# EAGLE design main (EAGLE 6.6.0)
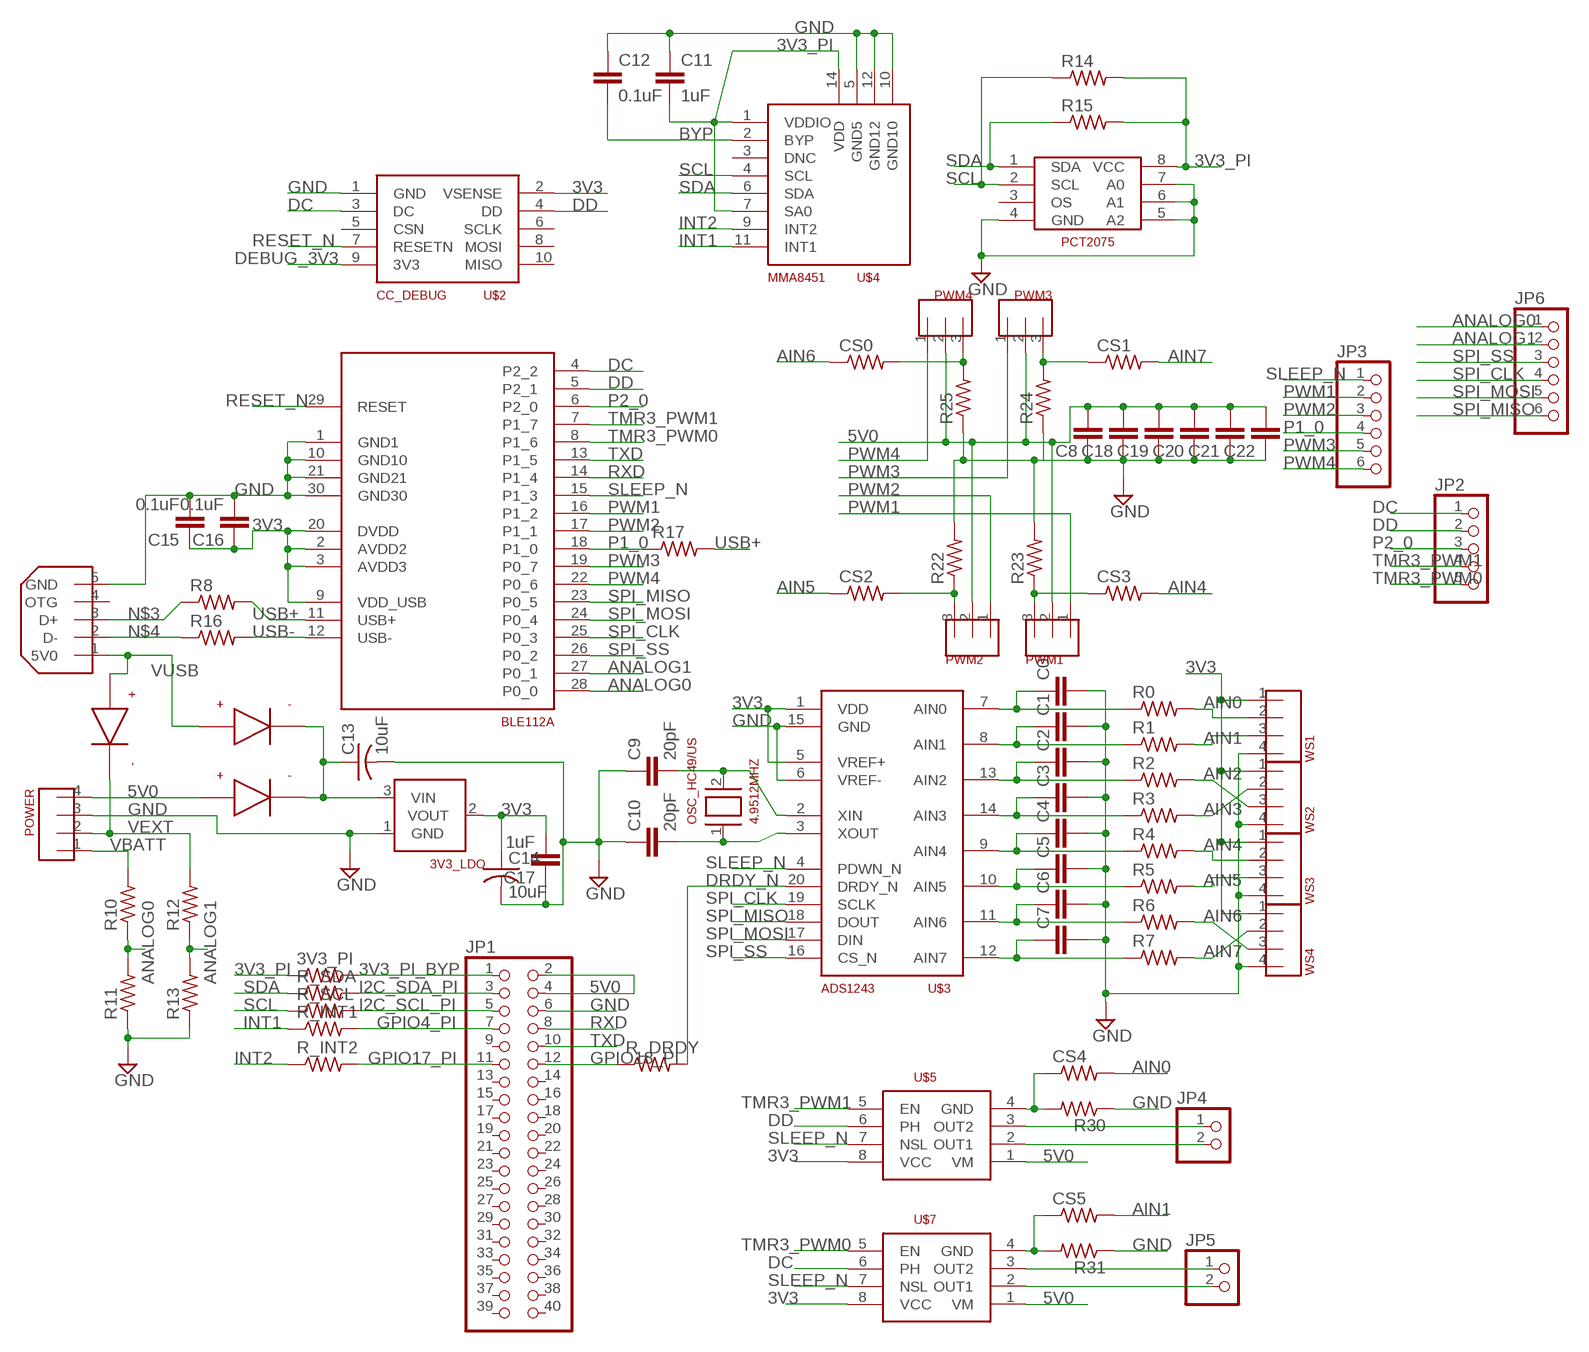
[diagram p0: schematic, sheet 1]

## Parts
3V3_LDO  MCP1700  [SOT23]
3V3_PI  R-US_R0603  [R0603]
4.9512MHZ  OSC_HC49/US  [HC49UP]
BLE112A  BLE112A  [BLE112]
C0  C-EUC0603  [C0603]
C1  C-EUC0603  [C0603]
C2  C-EUC0603  [C0603]
C3  C-EUC0603  [C0603]
C4  C-EUC0603  [C0603]
C5  C-EUC0603  [C0603]
C6  C-EUC0603  [C0603]
C7  C-EUC0603  [C0603]
C8  C-EUC0603  [C0603]
C9  20pF  C-EUC0603  [C0603]
C10  20pF  C-EUC0603  [C0603]
C11  1uF  C-EUC0603  [C0603]
C12  0.1uF  C-EUC0603  [C0603]
C13  10uF  C-USC0805  [C0805]
C14  10uF  C-USC0805  [C0805]
C15  0.1uF  C-EUC0603  [C0603]
C16  0.1uF  C-EUC0603  [C0603]
C17  1uF  C-EUC0603  [C0603]
C18  C-EUC0603  [C0603]
C19  C-EUC0603  [C0603]
C20  C-EUC0603  [C0603]
C21  C-EUC0603  [C0603]
C22  C-EUC0603  [C0603]
CS0  R-US_R0603  [R0603]
CS1  R-US_R0603  [R0603]
CS2  R-US_R0603  [R0603]
CS3  R-US_R0603  [R0603]
CS4  R-US_R0603  [R0603]
CS5  R-US_R0603  [R0603]
JP1  PINHD-2X20  [2X20]
JP2  PINHD-1X5  [1X05]
JP3  PINHD-1X6  [1X06]
JP4  PINHD-1X2  [1X02]
JP5  PINHD-1X2  [1X02]
JP6  PINHD-1X6  [1X06]
PCT2075  PCT2075  [SO-08]
POWER  HDR_SPOX4  [HDR_SPOX4]
PWM1  HDR_1X3  [HDR_1X3]
PWM2  HDR_1X3  [HDR_1X3]
PWM3  HDR_1X3  [HDR_1X3]
PWM4  HDR_1X3  [HDR_1X3]
R0  R-US_R0603  [R0603]
R1  R-US_R0603  [R0603]
R2  R-US_R0603  [R0603]
R3  R-US_R0603  [R0603]
R4  R-US_R0603  [R0603]
R5  R-US_R0603  [R0603]
R6  R-US_R0603  [R0603]
R7  R-US_R0603  [R0603]
R8  R-US_R0603  [R0603]
R10  R-US_R0603  [R0603]
R11  R-US_R0603  [R0603]
R12  R-US_R0603  [R0603]
R13  R-US_R0603  [R0603]
R14  R-US_R0603  [R0603]
R15  R-US_R0603  [R0603]
R16  R-US_R0603  [R0603]
R17  R-US_R0603  [R0603]
R22  R-US_R1206  [R1206]
R23  R-US_R1206  [R1206]
R24  R-US_R1206  [R1206]
R25  R-US_R1206  [R1206]
R30  R-US_R1206  [R1206]
R31  R-US_R1206  [R1206]
R_DRDY  R-US_R0603  [R0603]
R_INT1  R-US_R0603  [R0603]
R_INT2  R-US_R0603  [R0603]
R_SCL  R-US_R0603  [R0603]
R_SDA  R-US_R0603  [R0603]
U$1  SCHOTTKEY_DIODE_1206  [DIODE_1206]
U$2  CC_DEBUG  [HDR_2X5_127MM]
U$3  ADS1243  [TSSOP20]
U$4  MMA8451  [QFN16_3X3]
U$5  DRV8838  [WSON-8-PAD]
U$6  MICRO_USB  [MICRO_USB]
U$7  DRV8838  [WSON-8-PAD]
U$11  SCHOTTKEY_DIODE_1206  [DIODE_1206]
U$12  SCHOTTKEY_DIODE_1206  [DIODE_1206]
WS1  HDR_1X4  [HDR_1X4]
WS2  HDR_1X4  [HDR_1X4]
WS3  HDR_1X4  [HDR_1X4]
WS4  HDR_1X4  [HDR_1X4]

## Nets
3V3: 3V3_LDO.2(VOUT) BLE112A.2(AVDD2) BLE112A.3(AVDD3) BLE112A.9(VDD_USB) BLE112A.20(DVDD) C14.1 C15.1 C16.1 C17.2 U$2.2(VSENSE) U$3.1(VDD) U$3.5(VREF+) U$5.8(VCC) U$7.8(VCC) WS1.1 WS2.1 WS3.1 WS4.1
3V3_PI: 3V3_PI.1 C11.2 PCT2075.8(VCC) R14.2 R15.2 U$4.1(VDDIO) U$4.7(SA0) U$4.14(VDD)
3V3_PI_BYP: 3V3_PI.2 JP1.1
5V0: C8.2 C18.2 C19.2 C20.2 C21.2 C22.2 JP1.2 JP1.4 POWER.4 PWM1.2 PWM2.2 PWM3.2 PWM4.2 U$5.1(VM) U$7.1(VM) U$12.CATHODE+
AIN0: CS4.2 R0.2 WS1.2
AIN1: CS5.2 R1.2 WS1.3
AIN2: R2.2 WS2.3
AIN3: R3.2 WS2.2
AIN4: CS3.2 R4.2 WS3.2
AIN5: CS2.1 R5.2 WS3.3
AIN6: CS0.1 R6.2 WS4.3
AIN7: CS1.2 R7.2 WS4.2
ANALOG0: BLE112A.28(P0_0) JP6.1 R10.1 R11.2
ANALOG1: BLE112A.27(P0_1) JP6.2 R12.1 R13.2
BYP: C12.2 U$4.2(BYP)
DC: BLE112A.4(P2_2) JP2.1 U$2.3(DC) U$7.6(PH)
DD: BLE112A.5(P2_1) JP2.2 U$2.4(DD) U$5.6(PH)
DEBUG_3V3: U$2.9(3V3)
DRDY_N: R_DRDY.2 U$3.20(DRDY_N)
GND: 3V3_LDO.1(GND) BLE112A.1(GND1) BLE112A.10(GND10) BLE112A.21(GND21) BLE112A.30(GND30) C0.2 C1.2 C2.2 C3.2 C4.2 C5.2 C6.2 C7.2 C8.1 C9.1 C10.1 C11.1 C12.1 C13.2 C14.2 C15.2 C16.2 C17.1 C18.1 C19.1 C20.1 C21.1 C22.1 JP1.6 PCT2075.4(GND) PCT2075.5(A2) PCT2075.6(A1) PCT2075.7(A0) POWER.3 R11.1 R13.1 R22.2 R23.2 R24.1 R25.1 R30.1 R31.1 U$2.1(GND) U$3.6(VREF-) U$3.15(GND) U$4.5(GND5) U$4.10(GND10) U$4.12(GND12) U$6.5(GND) WS1.4 WS2.4 WS3.4 WS4.4
GPIO4_PI: JP1.7 R_INT1.2
GPIO17_PI: JP1.11 R_INT2.2
GPIO18_PI: JP1.12 R_DRDY.1
I2C_SCL_PI: JP1.5 R_SCL.2
I2C_SDA_PI: JP1.3 R_SDA.2
INT1: R_INT1.1 U$4.11(INT1)
INT2: R_INT2.1 U$4.9(INT2)
N$1: C0.1 R0.1 U$3.7(AIN0)
N$2: C1.1 R1.1 U$3.8(AIN1)
N$3: R8.1 U$6.3(D+)
N$4: R16.1 U$6.2(D-)
N$5: 3V3_LDO.3(VIN) C13.1 U$11.ANODE- U$12.ANODE-
N$6: C2.1 R2.1 U$3.13(AIN2)
N$7: C3.1 R3.1 U$3.14(AIN3)
N$8: C4.1 R4.1 U$3.9(AIN4)
N$9: C5.1 R5.1 U$3.10(AIN5)
N$10: C6.1 R6.1 U$3.11(AIN6)
N$11: C7.1 R7.1 U$3.12(AIN7)
N$12: JP4.1 U$5.3(OUT2)
N$13: CS2.2 PWM2.3 R22.1
N$14: CS3.1 PWM1.3 R23.1
N$15: CS0.2 PWM4.3 R25.2
N$16: CS1.1 PWM3.3 R24.2
N$21: JP4.2 U$5.2(OUT1)
N$22: JP5.1 U$7.3(OUT2)
N$23: JP5.2 U$7.2(OUT1)
N$24: 4.9512MHZ.2 C9.2 U$3.2(XIN)
N$25: 4.9512MHZ.1 C10.2 U$3.3(XOUT)
N$26: CS4.1 R30.2 U$5.4(GND)
N$27: CS5.1 R31.2 U$7.4(GND)
P1_0: BLE112A.18(P1_0) JP3.4 R17.1
P2_0: BLE112A.6(P2_0) JP2.3
PWM1: BLE112A.16(P1_2) JP3.2 PWM1.1
PWM2: BLE112A.17(P1_1) JP3.3 PWM2.1
PWM3: BLE112A.19(P0_7) JP3.5 PWM3.1
PWM4: BLE112A.22(P0_6) JP3.6 PWM4.1
RESET_N: BLE112A.29(RESET) U$2.7(RESETN)
RXD: BLE112A.14(P1_4) JP1.8
SCL: PCT2075.2(SCL) R14.1 R_SCL.1 U$4.4(SCL)
SDA: PCT2075.1(SDA) R15.1 R_SDA.1 U$4.6(SDA)
SLEEP_N: BLE112A.15(P1_3) JP3.1 U$3.4(PDWN_N) U$5.7(NSL) U$7.7(NSL)
SPI_CLK: BLE112A.25(P0_3) JP6.4 U$3.19(SCLK)
SPI_MISO: BLE112A.23(P0_5) JP6.6 U$3.18(DOUT)
SPI_MOSI: BLE112A.24(P0_4) JP6.5 U$3.17(DIN)
SPI_SS: BLE112A.26(P0_2) JP6.3 U$3.16(CS_N)
TMR3_PWM0: BLE112A.8(P1_6) JP2.5 U$7.5(EN)
TMR3_PWM1: BLE112A.7(P1_7) JP2.4 U$5.5(EN)
TXD: BLE112A.13(P1_5) JP1.10
USB+: BLE112A.11(USB+) R8.2 R17.2
USB-: BLE112A.12(USB-) R16.2
VBATT: POWER.1 R10.2
VEXT: POWER.2 R12.2 U$1.ANODE-
VUSB: U$1.CATHODE+ U$6.1(5V0) U$11.CATHODE+
Unconnected: JP1.9 JP1.13 JP1.14 JP1.15 JP1.16 JP1.17 JP1.18 JP1.19 JP1.20 JP1.21 JP1.22 JP1.23 JP1.24 JP1.25 JP1.26 JP1.27 JP1.28 JP1.29 JP1.30 JP1.31 JP1.32 JP1.33 JP1.34 JP1.35 JP1.36 JP1.37 JP1.38 JP1.39 JP1.40 PCT2075.3(OS) U$2.5(CSN) U$2.6(SCLK) U$2.8(MOSI) U$2.10(MISO) U$4.3(DNC) U$6.4(OTG)

## Library data of the parts
3V3_LDO = bleHAT:MCP1700
3V3_PI CS0 CS1-CS5 R0 R1-R8 R10-R17 R_DRDY R_INT1 R_INT2 R_SCL R_SDA = rcl:R-US_: RESISTOR, American symbol
4.9512MHZ = bleHAT:OSC_HC49/US
BLE112A = bleHAT:BLE112A
C0 C1-C12 C15-C22 = resistor:C-EU: CAPACITOR, European symbol
C13 C14 = resistor:C-US: CAPACITOR, American symbol
JP1 = pinhead:PINHD-2X20: PIN HEADER
JP2 = bleHAT:PINHD-1X5: PIN HEADER
JP3 JP6 = bleHAT:PINHD-1X6: PIN HEADER
JP4 JP5 = bleHAT:PINHD-1X2: PIN HEADER
PCT2075 = bleHAT:PCT2075
POWER = bleHAT:HDR_SPOX4
PWM1-PWM4 = bleHAT:HDR_1X3
R22-R25 R30 R31 = resistor:R-US_: RESISTOR, American symbol
U$1 U$11 U$12 = bleHAT:SCHOTTKEY_DIODE_1206
U$2 = bleHAT:CC_DEBUG
U$3 = bleHAT:ADS1243
U$4 = bleHAT:MMA8451
U$5 U$7 = bleHAT:DRV8838
U$6 = bleHAT:MICRO_USB
WS1-WS4 = bleHAT:HDR_1X4

## Board
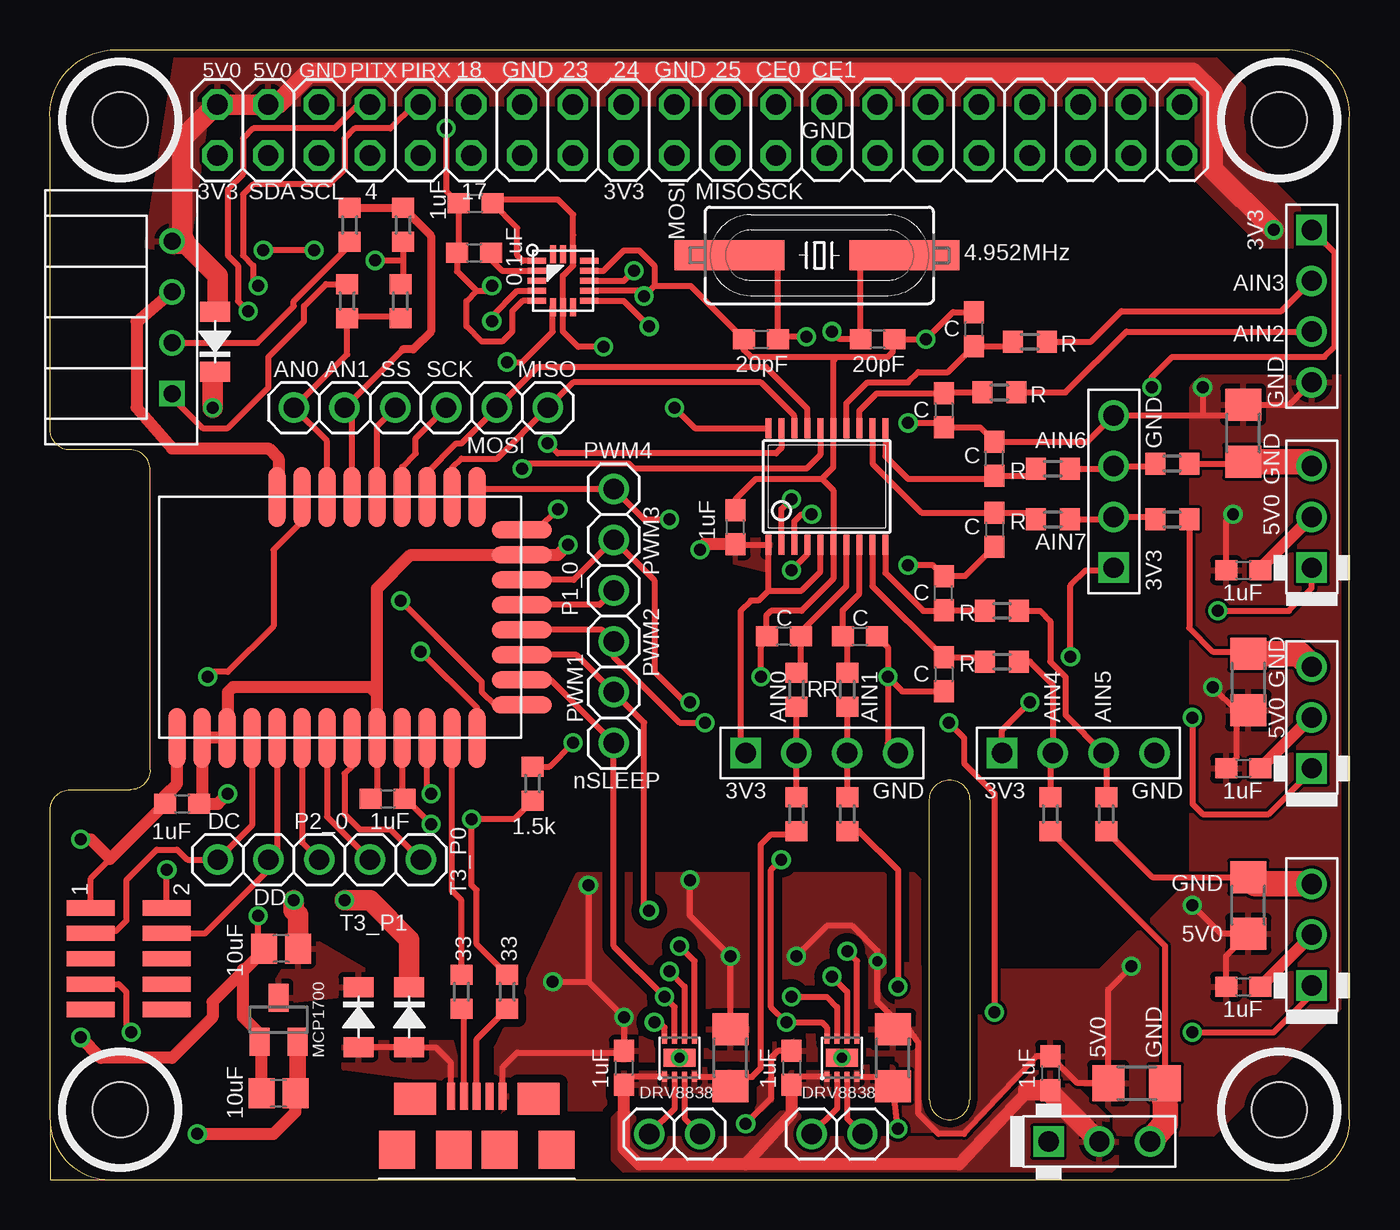
[diagram p1: board, top side]
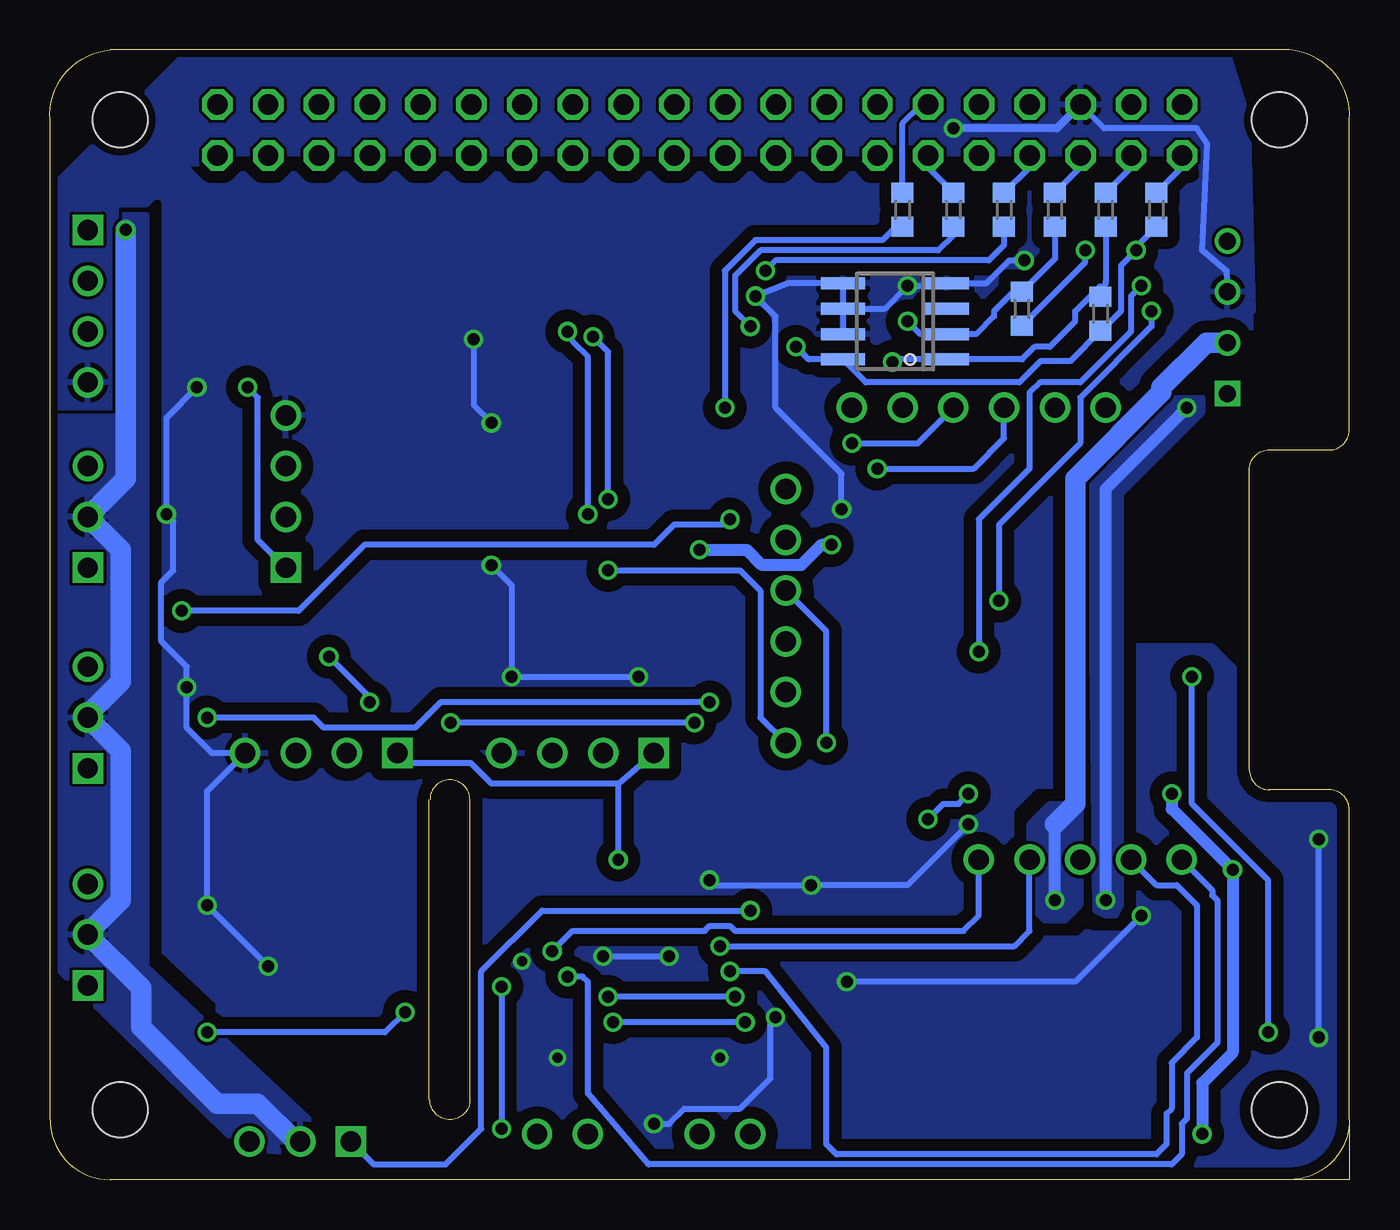
[diagram p2: board, bottom side, seen from below]

Size 65.02 x 56.5 mm. Coordinates in mm from the lower left corner, seen from the top.
Outline: 3.01,0 0.01,0 0.01,3
Outline: 0.01,3 arc90 3.01,0
Outline: 3.01,0 62.01,0 arc90 65.01,3 65.01,53 arc90 62.01,56.5 3.01,56.5 arc90 0.01,53 0.01,37.5 arc90 1.01,36.5 4.01,36.5 arc-90 5.01,35.5 5.01,20.5 arc-90 4.01,19.5 1.01,19.5 arc90 0.01,18.5 0.01,3
Outline: 46.01,19 arc180 44.01,19 44.01,4 arc180 46.01,4
Outline: 46.04,4 46.04,19
Copper layers (1*16): Top 0.0356mm / dielectric 1.5011mm / Bottom 0.0356mm
Design rules "LaenPCBOrder": minimum track width 6mil, minimum drill 13mil, track to track 6mil, track to pad 6mil, pad to pad 6mil, via to via 6mil, smd to smd 6mil, copper to edge 15mil, drill to drill 6mil, minimum pad ring 7mil, minimum via ring 7mil, stop-mask expansion 3mil, vias tented up to drill 0mil, thermal gap 10mil
Holes 2.75 mm at 3.51,3.5 61.51,3.5 3.51,53 61.51,53

### Footprints (pad centres in the part's own frame; a part is rotated, then mirrored left to right if it is on the bottom)
SOT23 = smd 1 x 1.4: 1 -0.95,-1.1; 2 0.95,-1.1; 3 0,1.1
R0603 = smd 1 x 1.1: 1 -0.85,0; 2 0.85,0
HC49UP = smd 5.5 x 1.5: 1 -4.25,0; 2 4.5,0
BLE112 = smd 3 x 0.85: 1 0,0; 2 0,-1.25; 3 0,-2.5; 4 0,-3.75; 5 0,-5; 6 0,-6.25; 7 0,-7.5; 8 0,-8.75; 9 0,-10; 10 0,-11.25; 11 0,-12.5; 12 0,-13.75; 13 0,-15; 22 12.05,-15; 23 12.05,-13.75; 24 12.05,-12.5; 25 12.05,-11.25; 26 12.05,-10; 27 12.05,-8.75; 28 12.05,-7.5; 29 12.05,-6.25; 30 12.05,-5 | smd 0.85 x 3: 14 1.65,-17.25; 15 2.9,-17.25; 16 4.15,-17.25; 17 5.4,-17.25; 18 6.65,-17.25; 19 7.9,-17.25; 20 9.15,-17.25; 21 10.4,-17.25
C0603 = smd 1.1 x 1: 1 -0.85,0; 2 0.85,0
C0805 = smd 1.3 x 1.5: 1 -0.85,0; 2 0.85,0
2X20 = drill 1.016 octagon: 1 -24.13,-1.27; 2 -24.13,1.27; 3 -21.59,-1.27; 4 -21.59,1.27; 5 -19.05,-1.27; 6 -19.05,1.27; 7 -16.51,-1.27; 8 -16.51,1.27; 9 -13.97,-1.27; 10 -13.97,1.27; 11 -11.43,-1.27; 12 -11.43,1.27; 13 -8.89,-1.27; 14 -8.89,1.27; 15 -6.35,-1.27; 16 -6.35,1.27; 17 -3.81,-1.27; 18 -3.81,1.27; 19 -1.27,-1.27; 20 -1.27,1.27; 21 1.27,-1.27; 22 1.27,1.27; 23 3.81,-1.27; 24 3.81,1.27; 25 6.35,-1.27; 26 6.35,1.27; 27 8.89,-1.27; 28 8.89,1.27; 29 11.43,-1.27; 30 11.43,1.27; 31 13.97,-1.27; 32 13.97,1.27; 33 16.51,-1.27; 34 16.51,1.27; 35 19.05,-1.27; 36 19.05,1.27; 37 21.59,-1.27; 38 21.59,1.27; 39 24.13,-1.27; 40 24.13,1.27
1X05 = drill 1.016: 1 -5.08,0; 2 -2.54,0; 3 0,0; 4 2.54,0; 5 5.08,0
1X06 = drill 1.016: 1 -6.35,0; 2 -3.81,0; 3 -1.27,0; 4 1.27,0; 5 3.81,0; 6 6.35,0
1X02 = drill 1.016: 1 -1.27,0; 2 1.27,0
SO-08 = smd 0.6 x 2.2: 1 -1.905,-2.6; 2 -0.635,-2.6; 3 0.635,-2.6; 4 1.905,-2.6; 5 1.905,2.6; 6 0.635,2.6; 7 -0.635,2.6; 8 -1.905,2.6
HDR_SPOX4 = drill 0.85 square: 1 -3.81,0 | drill 0.85: 2 -1.27,0; 3 1.27,0; 4 3.81,0
HDR_1X3 = drill 1.016 square: 1 -2.54,0 | drill 1.016: 2 0,0; 3 2.54,0
R1206 = smd 1.6 x 1.803: 1 -1.422,0; 2 1.422,0
DIODE_1206 = smd 1 x 1.5: ANODE- 1.5,0; CATHODE+ -1.5,0
HDR_2X5_127MM = smd 0.76 x 2.4: 1 -2.54,-2.54; 2 -2.54,1.27; 3 -1.27,-2.54; 4 -1.27,1.27; 5 0,-2.54; 6 0,1.27; 7 1.27,-2.54; 8 1.27,1.27; 9 2.54,-2.54; 10 2.54,1.27
TSSOP20 = smd 0.305 x 0.991: 1 -2.925,-2.918; 2 -2.275,-2.918; 3 -1.625,-2.918; 4 -0.975,-2.918; 5 -0.325,-2.918; 6 0.325,-2.918; 7 0.975,-2.918; 8 1.625,-2.918; 9 2.275,-2.918; 10 2.925,-2.918; 11 2.925,2.918; 12 2.275,2.918; 13 1.625,2.918; 14 0.975,2.918; 15 0.325,2.918; 16 -0.325,2.918; 17 -0.975,2.918; 18 -1.625,2.918; 19 -2.275,2.918; 20 -2.925,2.918
QFN16_3X3 = smd 0.913 x 0.305: 1 -1.3,1; 2 -1.3,0.5; 3 -1.3,0; 4 -1.3,-0.5; 5 -1.3,-1; 9 1.325,-1; 10 1.325,-0.5; 11 1.325,0; 12 1.325,0.5; 13 1.325,1 | smd 0.305 x 0.913: 6 -0.5,-1.325; 7 0,-1.325; 8 0.5,-1.325; 14 0.5,1.325; 15 0,1.325; 16 -0.5,1.325
WSON-8-PAD = smd 0.25 x 0.5: 1 -0.75,-0.95; 2 -0.25,-0.95; 3 0.25,-0.95; 4 0.75,-0.95; 5 0.75,0.95; 6 0.25,0.95; 7 -0.25,0.95; 8 -0.75,0.95 | smd 1.6 x 0.9: PAD 0,0
MICRO_USB = smd 0.4 x 1.35: 1 -1.3,2.675; 2 -0.65,2.675; 3 0,2.675; 4 0.65,2.675; 5 1.3,2.675 | smd 1.8 x 1.9: P$1 -4,0; P$2 4,0; P$3 1.15,0; P$4 -1.15,0 | smd 2.1 x 1.6: P$5 3.1,2.55; P$6 -3.1,2.55
HDR_1X4 = drill 1.016 square: 1 -3.81,0 | drill 1.016: 2 -1.27,0; 3 1.27,0; 4 3.81,0

### Placement (x,y rotation side)
3V3_LDO  11.44,8 0 top
3V3_PI  9.66,48.51 90 bottom
4.9512MHZ  38.49,46.23 180 top
BLE112A  6.36,22.1 90 top
C0  36.71,27.18 180 top
C1  40.52,27.18 0 top
C2  44.71,38.48 270 top
C3  46.24,42.55 90 top
C4  44.71,25.27 270 top
C5  44.71,29.34 90 top
C6  47.25,36.07 90 top
C7  47.25,32.51 270 top
C8  28.71,5.59 270 top
C9  35.57,42.04 0 top
C10  41.41,42.04 180 top
C11  21.28,48.83 0 top
C12  21.22,46.35 0 top
C13  11.57,11.56 180 top
C14  11.44,4.32 180 top
C15  16.9,19.05 0 top
C16  34.3,32.64 90 top
C17  6.61,18.8 0 top
C18  37.09,5.59 270 top
C19  50.05,5.33 270 top
C20  59.7,9.65 0 top
C21  59.7,20.57 0 top
C22  59.7,30.48 0 top
CS0  56.14,35.81 0 top
CS1  56.14,33.02 180 top
CS2  52.84,18.29 270 top
CS3  50.05,18.29 90 top
CS4  37.35,18.29 90 top
CS5  39.89,18.29 90 top
JP1  32.51,52.5 0 top
JP2  13.47,16 0 top
JP3  28.2,28.19 90 top
JP4  31.25,2.29 180 top
JP5  39.38,2.29 180 top
JP6  18.55,38.61 0 top
PCT2075  22.74,42.93 90 bottom
POWER  6.11,43.13 90 top
PWM1  52.5,1.91 0 top
PWM2  63.13,12.26 90 top
PWM3  63.13,23.11 90 top
PWM4  63.13,33.15 90 top
R0  37.35,24.51 270 top
R1  39.89,24.51 270 top
R2  47.51,39.37 0 top
R3  49.03,41.91 0 top
R4  47.63,25.91 0 top
R5  47.63,28.45 0 top
R6  50.17,35.56 0 top
R7  50.17,33.02 0 top
R8  22.87,9.4 90 top
R10  14.87,43.94 90 top
R11  17.54,43.94 270 top
R12  15,47.75 270 top
R13  17.66,47.75 90 top
R14  16.39,43.56 270 bottom
R15  12.46,43.31 270 bottom
R16  20.58,9.4 90 top
R17  24.14,19.81 270 top
R22  59.95,13.72 270 top
R23  54.37,4.83 180 top
R24  59.95,24.89 90 top
R25  59.7,37.34 270 top
R30  34.05,6.1 270 top
R31  42.17,6.1 270 top
R_DRDY  22.36,48.51 270 bottom
R_INT1  17.28,48.51 90 bottom
R_INT2  19.82,48.51 90 bottom
R_SCL  14.74,48.51 90 bottom
R_SDA  12.2,48.51 90 bottom
U$1  17.98,8.13 90 top
U$2  4.58,11.05 270 top
U$3  38.87,34.67 0 top
U$4  25.66,44.96 0 top
U$5  31.51,6.1 0 top
U$6  21.36,1.5 0 top
U$7  39.63,6.1 0 top
U$11  15.44,8.13 90 top
U$12  8.26,41.91 270 top
WS1  38.62,21.34 0 top
WS2  63.13,43.69 270 top
WS3  51.44,21.34 0 top
WS4  53.22,34.42 90 top

### Tracks (layer width: path | path; a pad name or v marks a point on that pad's centre or on a via)
3V3  (via drill 0.6)
  Top 0.305: BLE112A.9 16.36,19.36 C15.1 | 7.61,18.94 C17.2 | U$2.2 v5.85,15.49 | C14.1 12.39,4.93 | U$5.8 30.76,7.61 30.49,7.87 v30.24,7.87 | U$7.8 38.87,7.62 38.62,7.87 v36.84,7.87 36.08,8.64 36.08,15.49 v36.59,16 | 8.9,22.14 BLE112A.3 | C16.1 34.34,31.75 U$3.1 35.95,29.46 | 35.95,29.46 35.44,28.96 35.06,28.96 34.55,28.45 34.55,21.59 WS1.1 | WS3.1 47.63,22.48 v49.03,23.88 | v51.06,26.16 51.06,29.72 51.83,30.48 53.1,30.48 WS4.1 | v55.13,39.62 55.13,40.13 56.14,41.15 63.76,41.15 64.27,41.66 64.27,46.35 WS2.1 | 35.95,29.46 37.6,29.46 38.55,30.41 U$3.5
  Top 0.61: BLE112A.3 BLE112A.2 7.61,18.94 | C17.2 8.39,18.8 v8.9,19.3 | v7.38,2.29 11.19,2.29 12.29,3.39 C14.1 | BLE112A.9 16.36,24.29 | 16.36,24.29 16.01,24.64 9.15,24.64 8.9,24.38 8.9,22.14 | v25.92,31.75 25.42,31.25 BLE112A.20 18.05,31.25 16.36,29.56 16.36,24.29 | C16.1 32.74,31.79 v32.52,31.5
  Top 0.813: 12.39,4.93 3V3_LDO.2
  Bottom 0.305: v30.24,7.87 v36.84,7.87 | v36.59,16 36.59,19.81 | 36.59,19.81 WS1.1 | 36.59,19.81 42.94,19.81 43.95,20.83 47.13,20.83 WS3.1 | v49.03,23.88 49.03,24.13 v51.06,26.16 | WS4.1 54.62,32 54.62,39.12 v55.13,39.62
  Bottom 0.61: v8.9,19.3 8.9,18.54 v5.85,15.49 5.85,6.35 7.38,4.83 v7.38,2.29 | v25.92,31.75 26.43,31.75 27.44,30.73 29.4,30.73 30.16,31.5 v32.52,31.5
  pour Top: 34.3,32 36.08,32 35.82,30.48 33.79,30.99
3V3_PI  (via drill 0.6)
  Top 0.305: v27.7,41.66 26.43,41.66 25.66,42.42 U$4.7 25.66,45.21 26.17,45.72 26.17,46.23 U$4.14 26.16,47.24 26.17,47.24 26.17,48.26 25.41,49.02 22.32,49.02 C11.2 23.38,47.59 23.38,46.23 23.65,45.96 U$4.1 | v13.22,46.48 v10.68,46.48
  Bottom 0.305: v27.7,41.66 27.06,41.02 PCT2075.8 24.2,39.88 16.52,39.88 15.46,40.93 13.98,40.93 R15.2 12.42,42.46 11.44,43.43 11.44,45.72 v10.68,46.48 | R14.2 13.22,45.89 v13.22,46.48 | v10.68,46.48 10.42,46.23 | v10.68,46.48 10.68,46.65 3V3_PI.1
3V3_PI_BYP
  Bottom 0.305: 3V3_PI.2 8.38,50.65 JP1.1
5V0  (via drill 0.6)
  Top 0.305: U$5.1 29.12,5.15 C8.2 | U$7.1 37.25,5.15 C18.2 | 10.93,53.85 10.93,53.78 JP1.4
  Top 0.61: C18.2 37.09,3.3 34.81,0.76 | 34.81,0.76 29.47,0.76 28.71,1.52 C8.2 | 48.94,4.48 45.48,0.76 34.81,0.76 | 6.61,46.94 6.67,46.94 | 8.39,43.54 U$12.CATHODE+ | JP1.2 8.31,53.77 | C19.2 50.05,4.36 | PWM2.2 63.13,12.23 C20.2 | C22.2 60.55,30.57 PWM4.2 | 10.93,53.85 11.44,53.85 | C21.2 63.09,23.11
  Top 1.016: C19.2 48.94,4.48 | 6.67,46.94 8.39,45.21 8.39,43.54 | 8.31,53.77 6.61,52.07 6.61,46.94 | JP1.2 JP1.4 | 50.05,4.36 PWM1.2 | 11.44,53.85 12.96,55.37 57.16,55.37 58.18,54.36 58.18,50.55 v61.22,47.5 | 63.09,23.11 PWM3.2
  Top 1.27: POWER.4 6.61,46.94
  Bottom 0.61: PWM1.2 52.71,1.91 | PWM2.2 63.13,12.32
  Bottom 1.016: 52.71,1.91 54.62,3.81 56.65,3.81 60.46,7.62 60.46,9.59 PWM2.2 | 63.13,12.32 61.48,13.97 61.48,21.46 PWM3.2 63.13,23.24 61.48,24.89 61.48,31.5 PWM4.2 61.22,35.05 v61.22,47.5
  pour Top: 28.46,5.33 31.25,5.33 31.25,4.32 28.46,4.32
  pour Top: 39.38,5.33 37.09,5.33 37.09,4.32 39.38,4.32
  pour Top: 6.36,56.39 4.84,46.74 6.87,46.23 7.88,53.85 57.41,53.85 57.41,50.04 60.72,46.74 62.24,46.74 62.49,46.99 62.49,48.51 59.7,51.31 59.7,54.61 57.92,56.39
  pour Bottom (rank 2): 65.03,46.23 62.24,48.26 60.21,48.26 60.21,10.67 52.08,3.05 52.08,1.27 55.38,1.52 65.03,10.92
  pour Top: 53.35,0.76 53.35,2.54 50.56,5.33 49.03,5.33 45.98,2.03 38.62,2.03 37.35,3.3 36.59,3.3 35.32,2.03 30.24,2.03 28.97,3.3 28.46,3.3 28.2,3.05 28.2,1.02 29.22,0 52.59,0
AIN0
  Top 0.305: CS4.2 WS1.2 R0.2
AIN1
  Top 0.305: CS5.2 WS1.3 R1.2
AIN2
  Top 0.305: R2.2 50.81,39.37 53.86,42.42 WS2.3
AIN3
  Top 0.305: R3.2 52.08,41.91 53.6,43.43 61.6,43.43 WS2.2
AIN4
  Top 0.305: R4.2 49.03,25.91 50.17,24.77 WS3.2 50.05,21.21 CS3.2
AIN5
  Top 0.305: R5.2 49.54,28.45 50.05,27.94 50.05,25.91 50.81,25.15 50.81,23.24 WS3.3 52.84,21.21 CS2.1
AIN6
  Top 0.305: R6.2 53.1,35.56 WS4.3 55.17,35.69 CS0.1
AIN7
  Top 0.305: R7.2 53.1,33.02 WS4.2 55.17,33.15 CS1.2
ANALOG0
  Top 0.305: BLE112A.28 13.86,36.95 JP6.1 14.87,41.27 R10.1 14.96,43.18 17.45,43.18 arc-90 R11.2
ANALOG1
  Top 0.305: BLE112A.27 15.11,38.24 JP6.2 17.66,41.53
  Top 0.406: R12.1 R13.2 19.06,47.2 19.06,42.42 18.17,41.53 17.66,41.53
BYP
  Top 0.305: C12.2 22.07,46.01 22.62,45.47 24.41,45.47 U$4.2
DC  (via drill 0.6)
  Top 0.305: BLE112A.4 10.11,17.72 JP2.1 6.87,16 6.36,16.51 5.34,16.51 3.82,14.99 3.82,12.95 3.31,12.45 2.17,12.45 U$2.3 | v39.13,10.16 39.88,9.4 U$7.6
  Bottom 0.305: JP2.1 6.87,14.48 6.87,14.22 6.61,13.97 6.61,6.86 8.14,5.33 8.14,3.05 8.39,2.79 8.39,1.27 8.9,0.76 35.06,0.76 38.11,4.32 38.11,9.91 38.36,10.16 v39.13,10.16
DD  (via drill 0.6)
  Top 0.305: BLE112A.5 11.36,16.43 JP2.2 10.93,15.49 7.76,12.32 U$2.4 | v31,10.41 31.76,9.66 U$5.6
  Bottom 0.305: JP2.2 9.66,14.73 8.65,14.73 7.63,13.72 7.63,7.11 8.9,5.84 8.9,3.56 9.15,3.3 9.15,1.78 9.66,1.27 25.66,1.27 26.17,1.78 26.17,6.6 29.22,10.41 v31,10.41
DRDY_N  (via drill 0.6)
  Top 0.305: U$3.20 32.27,37.59 v31.25,38.61
  Bottom 0.305: R_DRDY.2 22.7,47.66 23.38,46.99 29.73,46.99 31.25,45.47 v31.25,38.61
GND  (via drill 0.5, 0.6)
  Top 0.305: R13.1 17.66,45.97 | 17.66,45.97 17.66,44.92 arc-90 R11.1 | v16.27,45.97 17.66,45.97 | v19.82,52.58 19.82,49.44 C11.1 20.43,46.42 C12.1 20.37,45.43 21.35,44.45 | 21.35,44.45 21.85,44.45 v22.11,44.7 | U$4.5 23.65,43.96 23.12,43.43 23.12,42.42 22.62,41.91 21.6,41.91 20.84,42.67 20.84,43.94 21.35,44.45 | U$4.10 29.47,44.46 v29.73,44.2 30.24,44.7 | U$4.12 27.69,45.46 28.71,46.48 29.47,46.48 30.24,45.72 30.24,44.7 | 30.24,44.7 32.05,44.7 C9.1 34.72,41.49 35.06,41.15 39.38,41.15 | 39.38,41.15 41.92,41.15 42.17,41.4 42.17,41.95 C10.1 v43.82,42.04 45.18,43.4 C3.2 | 39.38,41.15 39.2,40.97 U$3.15 39.2,35.63 38.62,35.05 | v42.94,37.85 44.5,37.85 C2.2 46.54,37.63 C6.2 51.91,36.92 WS4.4 57.67,38.23 | 57.67,38.23 59.42,38.23 R25.1 62.01,38.76 WS2.4 | C22.1 58.85,32.93 v59.19,33.27 | v57.67,39.62 57.67,38.23 | R24.1 59.34,23.47 | 59.34,23.47 v58.18,24.64 | 59.34,23.47 59.34,21.07 C21.1 | v57.16,13.72 58.58,12.29 R22.2 58.85,11.19 C20.1 | v54.11,10.67 52.94,9.5 R23.2 51.41,4.83 C19.1 49.37,6.18 45.73,2.29 44.46,2.29 43.44,3.3 43.44,6.86 42.94,7.62 42.28,7.62 R31.1 42.17,8.13 41.41,8.89 v41.41,10.92 41.41,11.43 40.14,12.7 38.87,12.7 v37.35,11.18 | C18.1 36.42,6.44 36.08,6.1 36.08,4.06 v34.81,2.79 | U$6.5 22.66,5.63 23.38,6.35 28.62,6.35 C8.1 v28.71,8.13 26.93,9.91 | C16.2 34.3,34.04 35.32,35.05 38.62,35.05 | 38.62,35.05 39.2,34.47 U$3.6 39.2,30.04 37.6,28.45 36.08,28.45 35.82,28.19 35.82,27.22 C0.2 35.57,26.63 v35.57,25.15 | C1.2 41.92,26.63 v41.92,25.15 | v41.92,25.15 41.92,21.84 WS1.4 | v41.92,25.15 42.64,24.42 C4.2 | C7.2 45.78,30.19 C5.2 44.17,30.73 v42.94,30.73 | R30.1 v34.05,11.18 32.01,13.21 v32.01,14.99
  Top 0.305: v26.93,14.73 26.93,9.91 | 10.59,6.8 3V3_LDO.1 10.49,7.3 | 9.66,10.5 C13.2 | U$2.1 2.04,15.07 3.01,16.05 | C13.2 10.72,11.47 | BLE112A.10 17.61,19.19 C15.2 17.79,19.05 v19.06,17.78 | C13.2 10.42,11.85 v10.42,13.21 | v25.16,9.91 26.93,9.91 | C17.1 5.76,19.22 | 11.44,34.23 BLE112A.30 | 4.33,42.93 4.38,42.93 | BLE112A.21 24.38,32.5 v25.41,33.53
  Top 0.61: C14.2 10.59,6.8 | 10.49,7.3 9.66,8.13 9.66,10.5 | C17.1 3.01,16.05 2.04,17.02 v1.53,17.02 | 10.72,11.47 8.14,8.89 8.14,8.13 6.11,6.1 2.55,6.1 v1.53,7.11 | 5.76,19.22 6.36,19.81 BLE112A.1 | 4.33,42.93 4.33,38.61 6.11,36.58 10.93,36.58 11.44,36.07 11.44,34.23 | 4.38,42.93 POWER.3
  Bottom 0.305: v16.27,45.97 17.03,45.97 18.17,44.83 PCT2075.4 20.27,44.7 v22.11,44.7 23.25,43.56 PCT2075.6 | JP1.6 12.27,52.58 7.63,52.58 7.12,51.82 7.38,46.48 6.16,45.47 POWER.3 | PCT2075.6 PCT2075.7 | PCT2075.6 PCT2075.5 28.08,44.83 v29.73,44.2 28.71,43.18 28.71,38.61 25.41,35.31 v25.41,33.53 | v43.82,42.04 43.82,38.73 v42.94,37.85 | v57.67,39.62 59.19,38.1 v59.19,33.27 58.85,32.93 C22.1 59.45,29.88 59.45,26.92 58.18,25.65 v58.18,24.64 58.18,22.61 56.91,21.34 WS3.4 57.16,19.43 v57.16,13.72 v54.11,10.67 | v37.35,11.18 v34.05,11.18 | v34.81,2.79 34.05,2.79 33.28,3.56 30.49,3.56 28.97,5.08 28.97,7.87 v28.71,8.13 | v35.57,25.15 v41.92,25.15 41.92,29.72 v42.94,30.73 | v32.01,14.99 31.76,14.73 v26.93,14.73 22.11,14.73 v19.06,17.78 | v1.53,7.11 v1.53,17.02 | v10.42,13.21 13.73,9.91 v25.16,9.91
  Bottom 0.406: JP1.6 14.65,52.58 v19.82,52.58
  other vias: 39.63,6.1 31.51,6.1
  pour Bottom (rank 2): 4.84,43.43 5.6,43.43 7.38,45.21 7.38,50.55 8.14,51.31 56.4,51.31 56.91,50.8 58.18,50.8 60.21,48.77 65.03,48.77 65.03,49.53 58.18,56.39 6.11,56.39 5.09,53.09
  pour Bottom: 61.73,49.02 61.73,38.61 65.03,38.61 65.03,49.02
  pour Top (rank 2): 61.99,40.13 65.03,40.13 65.03,9.14 58.18,2.29 42.68,2.29 42.43,2.79 42.43,10.92 43.95,10.41 52.59,10.41 57.16,14.99 57.16,39.62 57.67,40.13 61.73,40.13 61.99,39.88
  pour Top (isolate 0.406, rank 2): 22.36,3.3 22.36,6.6 26.43,15.24 43.19,15.24 43.95,14.48 43.95,4.06 43.44,3.56 22.62,3.56
  pour Bottom (isolate 0.61, rank 3): 0.01,0 0.01,18.8 0.77,19.56 4.58,19.56 5.34,20.32 5.34,25.15 6.87,26.67 11.44,26.67 13.22,28.45 13.22,35.31 12.71,35.81 7.63,38.1 4.84,38.1 5.09,49.53 5.09,51.05 57.92,51.05 60.46,48.51 60.46,10.92 49.54,0
GPIO4_PI
  Bottom 0.305: R_INT1.2 16,50.65 JP1.7
GPIO17_PI
  Bottom 0.305: R_INT2.2 21.08,50.62 JP1.11
GPIO18_PI
  Bottom 0.305: R_DRDY.1 22.36,52.83 21.42,53.77 JP1.12
I2C_SCL_PI
  Bottom 0.305: R_SCL.2 13.46,50.65 JP1.5
I2C_SDA_PI
  Bottom 0.305: R_SDA.2 10.92,50.65 JP1.3
INT1  (via drill 0.6)
  Top 0.305: U$4.11 28.71,44.96 v29.22,45.47
  Bottom 0.305: R_INT1.1 17.28,46.74 18.04,45.97 28.71,45.97 v29.22,45.47
INT2  (via drill 0.6)
  Top 0.305: v29.98,42.67 28.71,43.94 26.95,43.94 U$4.9
  Bottom 0.305: R_INT2.1 19.82,47.24 20.58,46.48 29.47,46.48 30.74,45.21 30.74,43.43 v29.98,42.67
N$1
  Top 0.305: R0.1 37.56,25.58 C0.1 37.6,27.22 37.6,27.43 39.85,29.68 U$3.7
N$2
  Top 0.305: R1.1 39.89,26.96 C1.1 39.67,28.49 40.5,29.31 U$3.8
N$3
  Top 0.305: U$6.3 21.36,7.04 R8.1
N$4
  Top 0.305: U$6.2 20.71,8.43 R16.1
N$5  (via drill 0.6)
  Top 0.61: 8.14,40.28 U$12.ANODE-
  Top 1.016: C13.1 12.42,13.25 12.2,13.46 v12.2,13.97 | v8.14,38.61 8.14,40.28
  Bottom 0.61: v12.2,13.97 12.2,34.54 v8.14,38.61
  pour Top: 11.19,9.65 11.19,8.89 16.01,9.4 15.76,10.41 12.71,12.19
  pour Bottom: 7.38,39.12 7.38,38.35 11.44,34.29 11.44,13.72 11.69,13.21 12.2,13.21 12.71,13.46 12.96,34.8 8.9,39.12
N$6
  Top 0.305: U$3.13 40.5,38.45 41.37,39.33 C2.1 44.75,39.37 R2.1
N$7
  Top 0.305: U$3.14 39.85,38.82 40.9,39.88 42.94,39.88 43.44,40.39 44.93,40.39 C3.1 47.97,41.7 R3.1
N$8
  Top 0.305: U$3.9 41.15,29.69 C4.1 46.57,26.12 R4.1
N$9
  Top 0.305: U$3.10 41.8,30.35 43.7,28.45 44.67,28.45 C5.1 46.75,28.49 R5.1
N$10
  Top 0.305: U$3.11 41.8,36.19 42.94,35.05 47.09,35.05 C6.1 48.98,35.22 R6.1
N$11
  Top 0.305: U$3.12 41.16,37.58 41.16,35.81 43.61,33.36 C7.1 48.98,33.36 R7.1
N$12
  Top 0.305: U$5.3 31.76,3.05 JP4.1
N$13
  Top 0.305: CS2.2 55.14,15.14 R22.1 60.3,14.8
  Top 1.27: 60.3,14.8 PWM2.3
N$14
  Top 0.305: CS3.1 55.79,11.7 R23.1
  Top 1.27: R23.1 55.8,2.81 PWM1.3
N$15
  Top 0.305: CS0.2 59.85,35.81 R25.2
  Top 1.27: R25.2 62.9,35.92 PWM4.3
N$16
  Top 0.305: CS1.1 56.99,27.6 58.18,26.42 59.85,26.42 R24.2
  Top 1.27: R24.2 62.47,26.31 PWM3.3
N$21
  Top 0.305: U$5.2 31.26,3.56 JP4.2
N$22
  Top 0.305: U$7.3 39.88,3.05 JP5.1
N$23
  Top 0.305: U$7.2 39.38,3.56 JP5.2
N$24  (via drill 0.6)
  Top 0.305: U$3.2 36.6,33.54 v37.09,34.04 | 4.9512MHZ.2 36.08,46.23 36.42,45.89 C9.2 36.55,42.16 v37.86,42.16
  Bottom 0.305: v37.09,34.04 37.09,41.4 v37.86,42.16
N$25  (via drill 0.6)
  Top 0.305: U$3.3 37.25,32.92 37.6,33.27 v38.11,33.27 | 4.9512MHZ.1 40.9,46.23 40.56,45.89 C10.2 39.51,42.04 v39.13,42.42
  Bottom 0.305: v38.11,33.27 38.11,41.15 38.87,41.91 v39.13,42.42
N$26
  Top 0.305: U$5.4 33.83,5.15 | 33.83,5.15 R30.2 | 33.83,5.15 35.13,5.15 35.57,5.59 35.57,16.76 36.08,17.27 37.18,17.27 CS4.1
  pour Top: 31.76,5.59 31.76,4.57 34.3,4.06 34.3,5.33
N$27  (via drill 0.6)
  Top 0.305: U$7.4 41.96,5.15 R31.2 v42.43,2.54 | CS5.1 40.48,17.44 42.43,15.49 v42.43,9.65
  Bottom 0.305: v42.43,9.65 v42.43,2.54
  pour Top: 39.89,5.59 39.89,4.57 42.17,4.06 42.17,5.59
P1_0  (via drill 0.6)
  Top 0.305: JP3.4 27.49,28.75 BLE112A.18 | R17.1 24.99,20.66 v26.17,21.84
  Bottom 0.305: v26.17,21.84 26.17,27.43 JP3.4
P2_0
  Top 0.305: BLE112A.6 12.61,16.86 JP2.3
PWM1  (via drill 0.6)
  Top 0.305: BLE112A.16 26.34,26.25 JP3.2 29.73,22.86 29.73,13.72 v29.98,13.46
  Bottom 0.305: PWM1.1 48.82,0.76 45.22,0.76 43.44,2.54 43.44,10.41 40.4,13.46 v29.98,13.46
PWM2  (via drill 0.6)
  Top 0.305: BLE112A.17 27.63,27.5 JP3.3 28.2,26.16 31.51,22.86 v32.78,22.86 | v44.97,22.86 45.73,22.1 45.73,20.83 47.25,19.3 v47.25,8.38 | v57.16,7.37 61.22,7.37 63.13,9.27 PWM2.1
  Bottom 0.305: v32.78,22.86 v44.97,22.86 | v47.25,8.38 48.27,7.37 v57.16,7.37
PWM3  (via drill 0.6)
  Top 0.305: BLE112A.19 26.2,30 JP3.5 30.24,29.97 30.24,25.4 31.76,23.88 v32.01,23.88 | v57.16,23.11 57.16,18.8 57.67,18.29 60.97,18.29 63.13,20.45 PWM3.1
  Bottom 0.305: v32.01,23.88 45.48,23.88 46.75,22.61 51.32,22.61 51.83,23.11 v57.16,23.11
PWM4  (via drill 0.6)
  Top 0.305: BLE112A.22 21.76,34.54 JP3.6 29.73,33.02 v31,33.02 | v58.43,28.45 61.99,28.45 63.13,29.59 PWM4.1
  Bottom 0.305: v31,33.02 31.25,32.77 33.79,32.77 34.81,31.75 49.29,31.75 52.59,28.45 v58.43,28.45
RESET_N  (via drill 0.6)
  Top 0.305: U$2.7 3.44,9.78 3.82,9.4 3.82,7.62 v4.07,7.37 | BLE112A.29 12.61,32.92 11.19,31.5 11.19,27.69 8.9,25.4 8.14,25.4 v7.88,25.15
  Bottom 0.305: v4.07,7.37 4.07,14.99 7.88,18.8 v7.88,25.15
RXD  (via drill 0.6)
  Top 0.305: JP1.8 15.43,53.77 14.23,52.58 10.17,52.58 9.66,52.07 9.66,50.29 8.9,49.53 8.9,46.23 9.41,45.72 9.41,43.94 v9.92,43.43 | v17.54,28.96 21.6,24.89 21.6,24.38 22.24,23.75 BLE112A.14
  Bottom 0.305: v9.92,43.43 9.92,42.67 13.47,39.12 13.47,36.83 17.54,32.77 v17.54,28.96
SCL  (via drill 0.6)
  Top 0.305: v22.11,42.93 22.11,43.18 23.38,44.45 24.41,44.45 U$4.4
  Bottom 0.305: R_SCL.1 14.74,46.06 R14.1 16.81,44.41 17.79,43.43 17.79,43.18 18.68,42.29 PCT2075.2 21.47,42.29 v22.11,42.93
SDA  (via drill 0.6)
  Top 0.305: v22.87,40.89 23.63,40.89 25.16,42.42 25.16,43.67 U$4.6
  Bottom 0.305: v22.87,40.89 22.74,41.02 PCT2075.1 16.39,41.02 15.76,41.66 15,41.66 13.73,42.93 13.73,43.43 12.49,44.66 R15.1 12.2,44.92 R_SDA.1
SLEEP_N  (via drill 0.6)
  Top 0.305: U$5.7 31.26,8.63 v30.74,9.14 28.2,11.68 JP3.1 25.05,25 BLE112A.15 | v37.09,9.14 38.87,9.14 39.38,8.63 U$7.7 | U$3.4 37.9,31.28 v37.09,30.48
  Bottom 0.305: v30.74,9.14 v37.09,9.14 | v37.09,30.48 30.49,30.48 29.47,29.46 29.47,23.11 JP3.1
SPI_CLK  (via drill 0.6)
  Top 0.305: BLE112A.25 17.61,35.63 18.3,36.32 18.3,37.08 JP6.4 | U$3.19 36.6,36.58 36.59,36.58 36.33,36.32 25.41,36.32 v24.9,36.83
  Bottom 0.305: v24.9,36.83 21.6,36.83 JP6.4
SPI_MISO
  Top 0.305: BLE112A.23 20.11,35.59 20.58,36.07 22.36,36.07 JP6.6 26.17,39.88 35.57,39.88 37.25,38.2 U$3.18
SPI_MOSI
  Top 0.305: BLE112A.24 18.86,35.36 20.33,36.83 20.58,36.83 JP6.5 24.39,40.64 35.82,40.64 37.9,38.57 U$3.17
SPI_SS  (via drill 0.6)
  Top 0.305: BLE112A.26 16.36,37.69 JP6.3 | U$3.16 38.55,36.25 37.86,35.56 29.22,35.56 28.97,35.81 23.89,35.81 v23.63,35.56
  Bottom 0.305: v23.63,35.56 18.81,35.56 17.28,37.08 JP6.3
TMR3_PWM0  (via drill 0.6)
  Top 0.305: BLE112A.8 15.11,20.69 14.74,20.32 14.74,18.29 15.5,17.53 17.03,17.53 JP2.5 | U$7.5 40.38,10.93 v39.89,11.43
  Bottom 0.305: v39.89,11.43 38.87,12.45 32.27,12.45 32.01,12.7 31,12.7 30.74,12.45 19.31,12.45 18.55,13.21 JP2.5
TMR3_PWM1  (via drill 0.6)
  Top 0.305: BLE112A.7 13.86,18.15 JP2.4 | U$5.5 32.26,10.93 v31.51,11.68
  Bottom 0.305: v31.51,11.68 16.77,11.68 16.01,12.45 JP2.4
TXD  (via drill 0.6)
  Top 0.305: JP1.10 18.22,53.77 17.03,52.58 15.25,52.58 14.74,52.07 14.74,50.55 13.98,49.78 10.17,49.78 9.66,49.28 9.66,46.23 10.17,45.72 10.17,44.96 v10.42,44.7 | v18.55,26.42 21.36,23.61 BLE112A.13
  Bottom 0.305: v10.42,44.7 10.93,44.2 10.93,42.42 13.47,39.88 15.5,39.88 16.01,39.37 16.01,35.56 18.55,33.02 v18.55,26.42
USB+  (via drill 0.6)
  Top 0.305: R8.2 21.35,11.77 21.35,14.48 21.09,14.73 v21.09,18.03 23.21,18.03 R17.2 | v19.06,19.3 18.86,19.5 BLE112A.11
  Bottom 0.305: v21.09,18.03 20.33,18.8 19.57,18.8 v19.06,19.3
USB-
  Top 0.305: R16.2 20.58,13.97 20.11,14.44 BLE112A.12
VBATT
  Top 0.305: 6.16,39.37 5.85,39.37 7.63,37.59 8.9,37.59 10.93,39.62 10.93,41.15 12.71,42.93 12.71,43.69 13.81,44.79 R10.2
  Top 0.61: POWER.1 6.16,39.37
VEXT  (via drill 0.6)
  Top 0.305: POWER.2 10.37,41.86 12.2,43.69 12.2,43.94 15,46.74 R12.2
  Top 1.016: U$1.ANODE- 17.98,12 16.01,13.97 v14.74,13.97
  Bottom 0.61: v14.74,13.97 14.74,17.78
  Bottom 1.016: 14.74,17.78 13.73,18.8 13.73,35.05 9.41,39.37 9.41,39.62 7.17,41.86 POWER.2
  pour Bottom: 13.47,18.8 13.47,13.72 14.23,12.95 15.25,12.95 16.01,13.72 16.01,17.78 15,18.8
VUSB
  Top 0.305: U$6.1 20.06,5.86 19.31,6.6 18,6.6 U$1.CATHODE+ U$11.CATHODE+
  pour Top: 14.74,6.86 20.08,6.86 20.58,4.83 14.74,5.59

### Text on the board
tPlace: GND | 23 | 24 | GND | 25 | CE0 | CE1 | GND | 3V3 | MISO | SCK | MOSI
tNames: 5V0 | 5V0 | GND | PITX | PIRX | 18 | 3V3 | SDA | SCL | 4 | 17 | 1uF | 4.952MHz | 3V3 | 0.1uF | AIN3 | C | AIN2 | R | AN0 | AN1 | SS | SCK | MISO | 20pF | 20pF | R | GND | C | AIN6 | GND | GND | MOSI | PWM4 | C | R | 5V0 | R | 1uF | C | AIN7 | PWM3 | C | 3V3 | 1uF | P1_0 | C | C | R | GND | PWM2 | C | R | R | R | 5V0 | PWM1 | AIN0 | AIN1 | AIN4 | AIN5 | nSLEEP | 3V3 | GND | 3V3 | GND | 1uF | DC | P2_0 | 1uF | 1uF | 1.5k | GND | DD | T3_P0 | 5V0 | T3_P1 | 33 | 33 | 10uF | 1uF | MCP1700 | 5V0 | GND | 1uF | 1uF | 1uF | DRV8838 | DRV8838 | 10uF